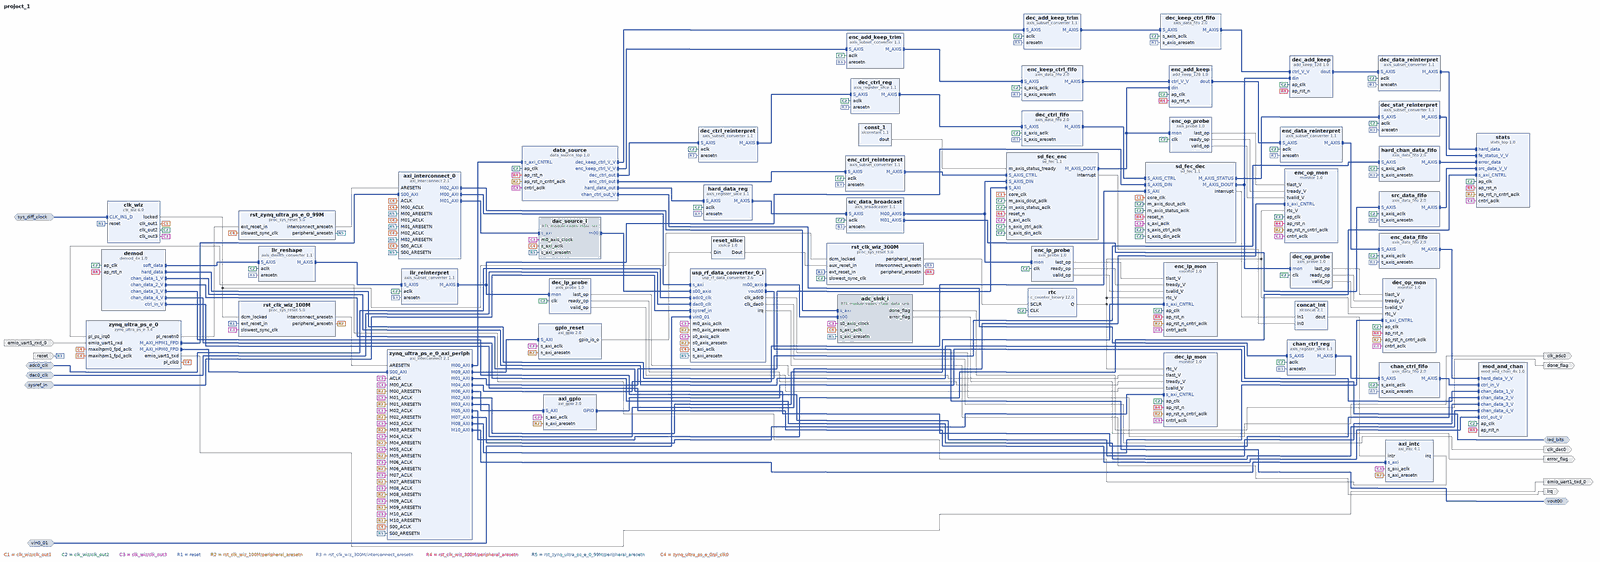
[diagram p0: block diagram of the top level, whole]
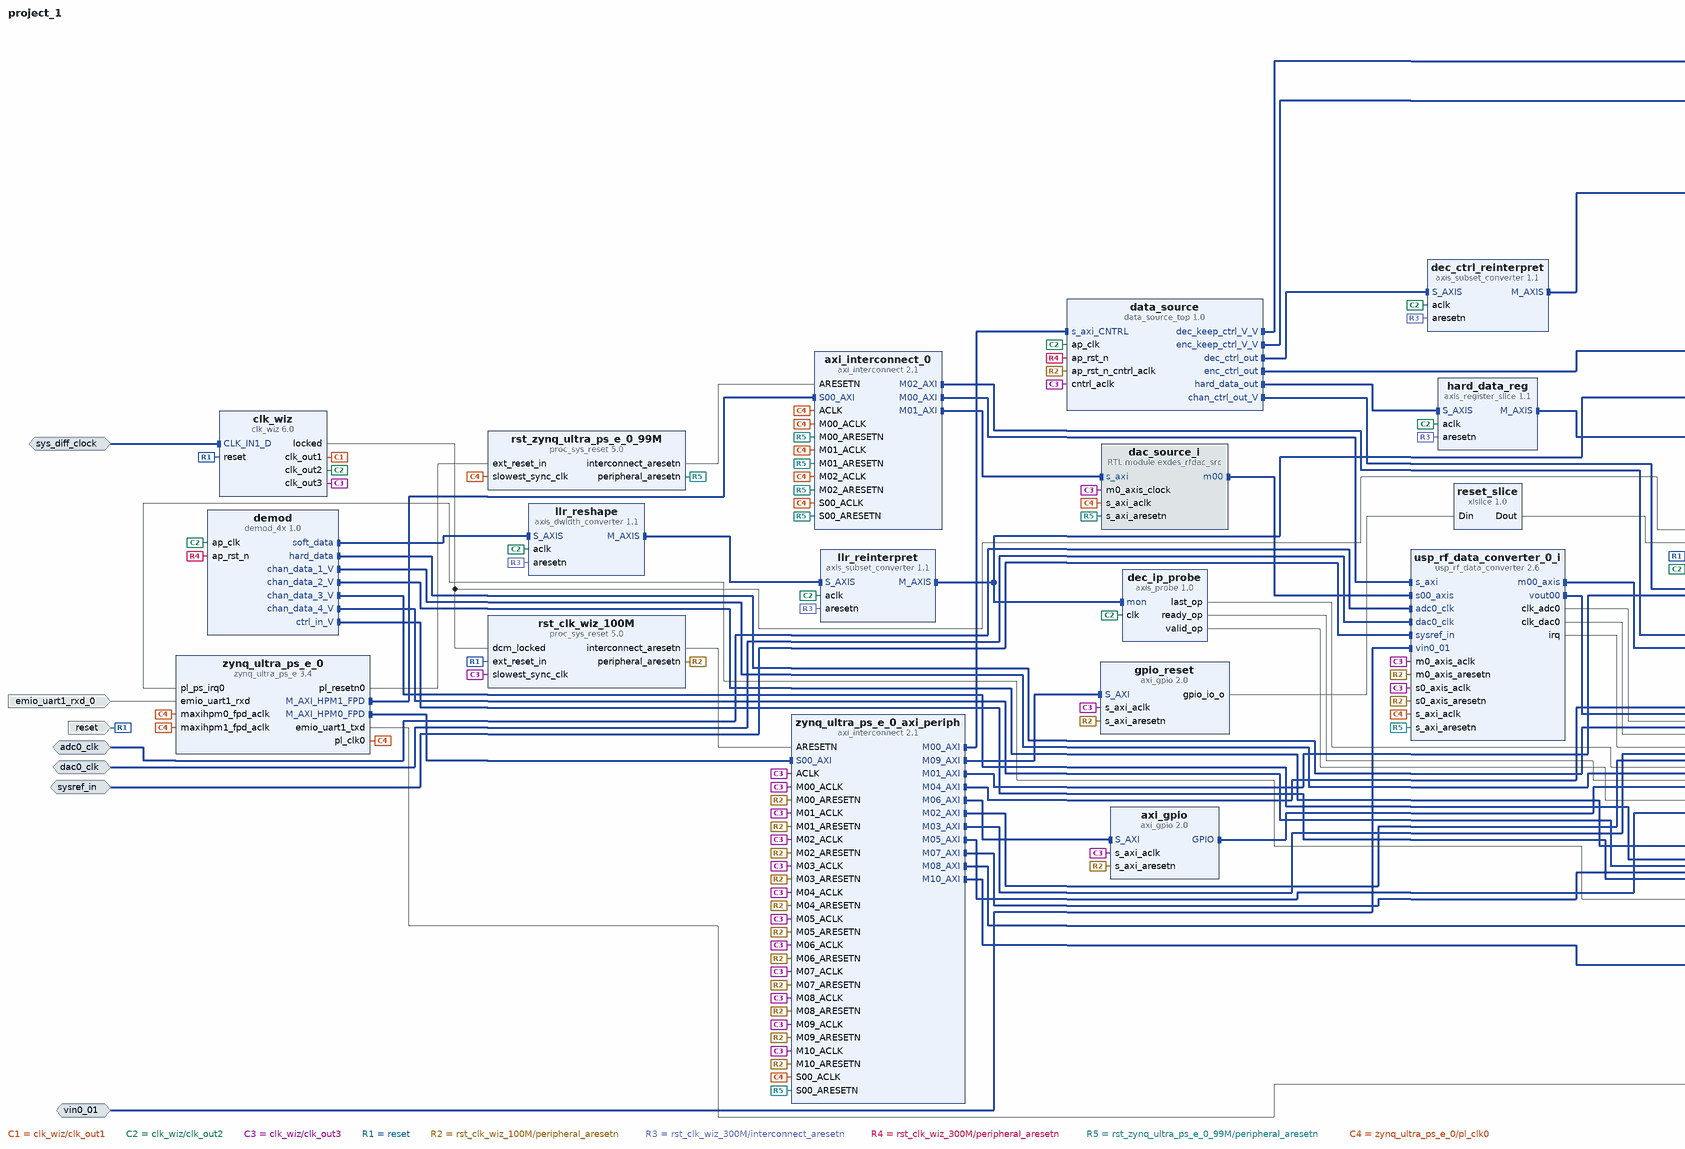
[diagram p1: block diagram of the top level, left part]
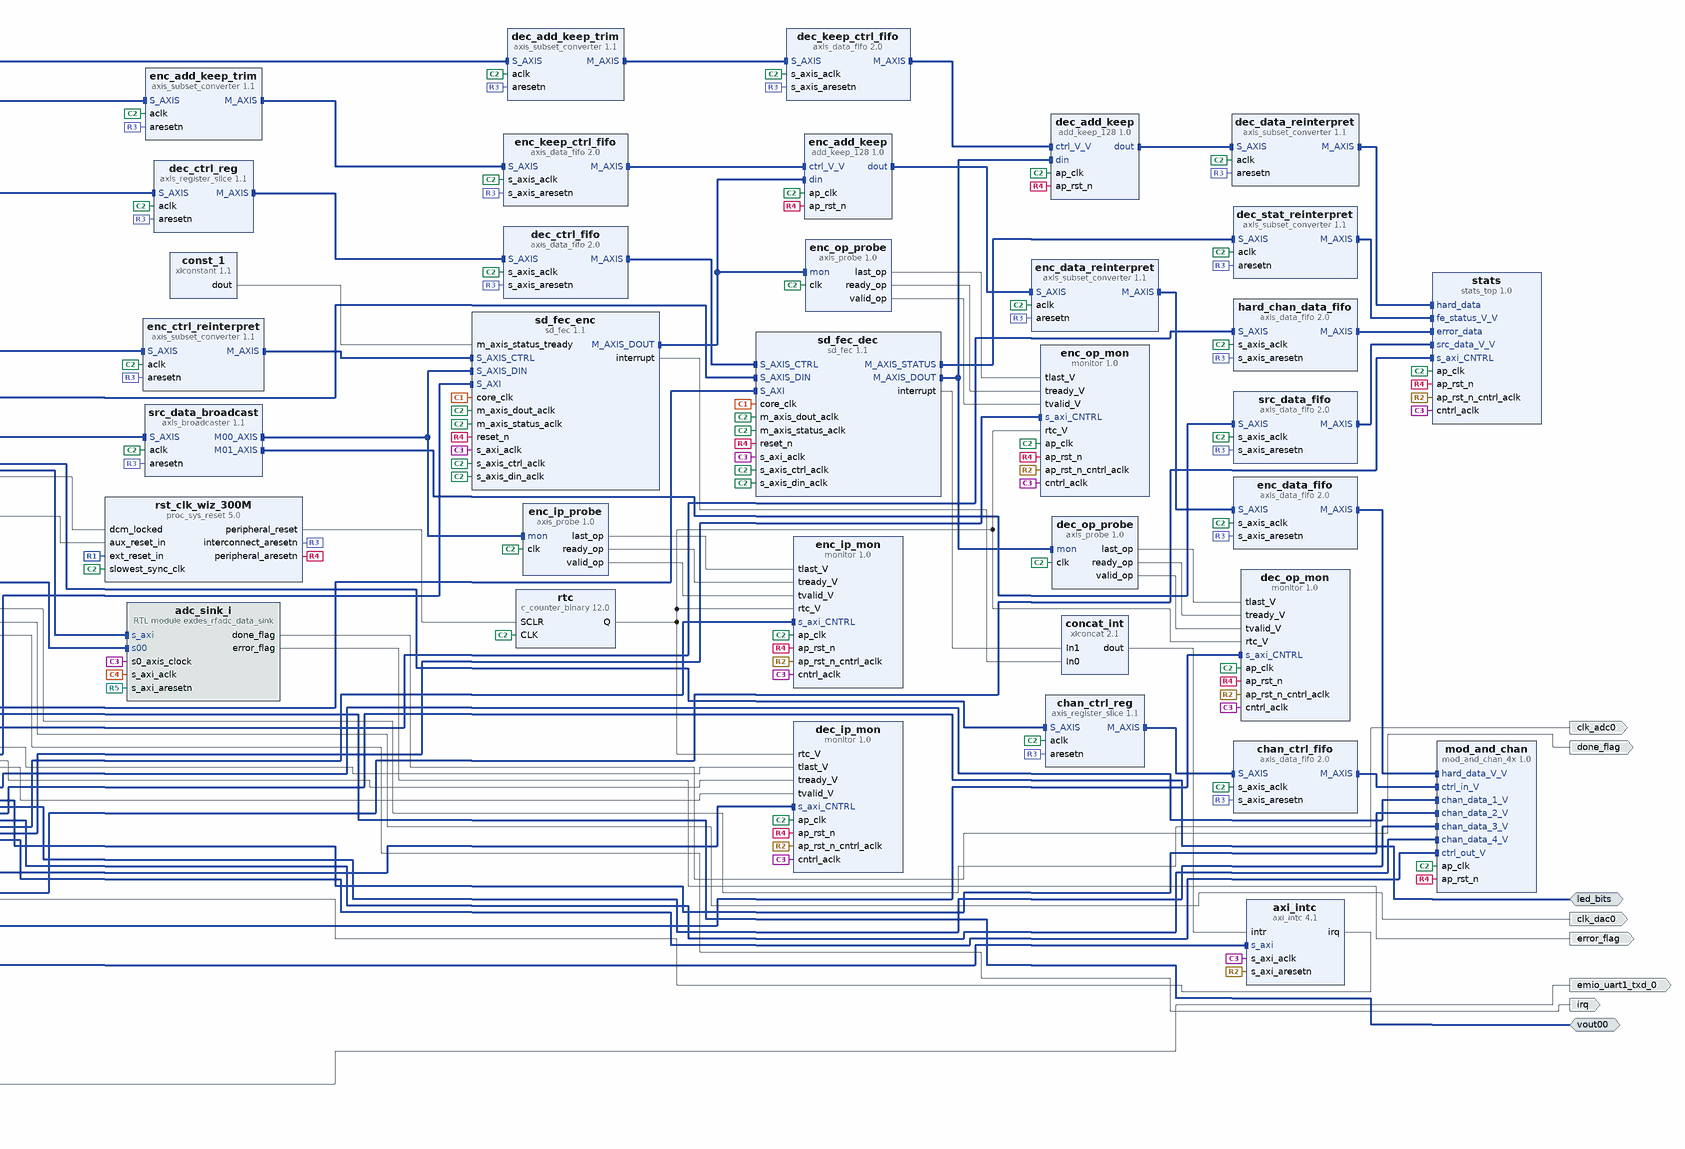
[diagram p2: block diagram of the top level, right part]
# Vivado block design project_1, xczu28dr-ffvg1517-2-e, Vivado 2022.2
create_bd_design project_1

create_bd_intf_port -mode Slave -vlnv xilinx.com:interface:diff_clock_rtl:1.0 adc0_clk
set_property -dict {CONFIG.FREQ_HZ 2000000000.0} [get_bd_intf_ports adc0_clk]
create_bd_intf_port -mode Slave -vlnv xilinx.com:interface:diff_clock_rtl:1.0 dac0_clk
set_property -dict {CONFIG.FREQ_HZ 6400000000.0} [get_bd_intf_ports dac0_clk]
create_bd_intf_port -mode Master -vlnv xilinx.com:interface:gpio_rtl:1.0 led_bits
create_bd_intf_port -mode Slave -vlnv xilinx.com:interface:diff_clock_rtl:1.0 sys_diff_clock
set_property -dict {CONFIG.FREQ_HZ 100000000} [get_bd_intf_ports sys_diff_clock]
create_bd_intf_port -mode Slave -vlnv xilinx.com:display_usp_rf_data_converter:diff_pins_rtl:1.0 sysref_in
create_bd_intf_port -mode Slave -vlnv xilinx.com:interface:diff_analog_io_rtl:1.0 vin0_01
create_bd_intf_port -mode Master -vlnv xilinx.com:interface:diff_analog_io_rtl:1.0 vout00
create_bd_port -dir O -type clk clk_adc0
set_property -dict {CONFIG.FREQ_HZ 125000000.0} [get_bd_ports clk_adc0]
create_bd_port -dir O -type clk clk_dac0
set_property -dict {CONFIG.FREQ_HZ 400000000.0} [get_bd_ports clk_dac0]
create_bd_port -dir O done_flag
create_bd_port -dir I emio_uart1_rxd_0
create_bd_port -dir O emio_uart1_txd_0
create_bd_port -dir O error_flag
create_bd_port -dir O irq
create_bd_port -dir I -type rst reset
set_property -dict {CONFIG.POLARITY ACTIVE_HIGH} [get_bd_ports reset]

create_bd_cell -type ip -vlnv xilinx.com:ip:zynq_ultra_ps_e:3.4 zynq_ultra_ps_e_0
set_property -dict [list \
  CONFIG.PSU_BANK_0_IO_STANDARD LVCMOS18 \
  CONFIG.PSU_BANK_1_IO_STANDARD LVCMOS18 \
  CONFIG.PSU_BANK_2_IO_STANDARD LVCMOS18 \
  CONFIG.PSU_BANK_3_IO_STANDARD LVCMOS33 \
  CONFIG.PSU_DYNAMIC_DDR_CONFIG_EN 1 \
  CONFIG.PSU_USB3__DUAL_CLOCK_ENABLE 1 \
  CONFIG.PSU__CAN1__PERIPHERAL__ENABLE 0 \
  CONFIG.PSU__CRF_APB__ACPU_CTRL__FREQMHZ 1200 \
  CONFIG.PSU__CRF_APB__ACPU_CTRL__SRCSEL APLL \
  CONFIG.PSU__CRF_APB__APLL_CTRL__SRCSEL PSS_REF_CLK \
  CONFIG.PSU__CRF_APB__DBG_FPD_CTRL__FREQMHZ 250 \
  CONFIG.PSU__CRF_APB__DBG_FPD_CTRL__SRCSEL IOPLL \
  CONFIG.PSU__CRF_APB__DBG_TRACE_CTRL__FREQMHZ 250 \
  CONFIG.PSU__CRF_APB__DBG_TRACE_CTRL__SRCSEL IOPLL \
  CONFIG.PSU__CRF_APB__DBG_TSTMP_CTRL__FREQMHZ 250 \
  CONFIG.PSU__CRF_APB__DBG_TSTMP_CTRL__SRCSEL IOPLL \
  CONFIG.PSU__CRF_APB__DDR_CTRL__FREQMHZ 1067 \
  CONFIG.PSU__CRF_APB__DDR_CTRL__SRCSEL DPLL \
  CONFIG.PSU__CRF_APB__DPDMA_REF_CTRL__FREQMHZ 600 \
  CONFIG.PSU__CRF_APB__DPDMA_REF_CTRL__SRCSEL APLL \
  CONFIG.PSU__CRF_APB__DPLL_CTRL__SRCSEL PSS_REF_CLK \
  CONFIG.PSU__CRF_APB__DP_AUDIO_REF_CTRL__SRCSEL RPLL \
  CONFIG.PSU__CRF_APB__DP_STC_REF_CTRL__SRCSEL RPLL \
  CONFIG.PSU__CRF_APB__DP_VIDEO_REF_CTRL__SRCSEL VPLL \
  CONFIG.PSU__CRF_APB__GDMA_REF_CTRL__FREQMHZ 600 \
  CONFIG.PSU__CRF_APB__GDMA_REF_CTRL__SRCSEL APLL \
  CONFIG.PSU__CRF_APB__GPU_REF_CTRL__FREQMHZ 500 \
  CONFIG.PSU__CRF_APB__GPU_REF_CTRL__SRCSEL IOPLL \
  CONFIG.PSU__CRF_APB__TOPSW_LSBUS_CTRL__FREQMHZ 100 \
  CONFIG.PSU__CRF_APB__TOPSW_LSBUS_CTRL__SRCSEL IOPLL \
  CONFIG.PSU__CRF_APB__TOPSW_MAIN_CTRL__FREQMHZ 533.33 \
  CONFIG.PSU__CRF_APB__TOPSW_MAIN_CTRL__SRCSEL DPLL \
  CONFIG.PSU__CRF_APB__VPLL_CTRL__SRCSEL PSS_REF_CLK \
  CONFIG.PSU__CRL_APB__ADMA_REF_CTRL__FREQMHZ 500 \
  CONFIG.PSU__CRL_APB__ADMA_REF_CTRL__SRCSEL IOPLL \
  CONFIG.PSU__CRL_APB__CAN1_REF_CTRL__FREQMHZ 100 \
  CONFIG.PSU__CRL_APB__CAN1_REF_CTRL__SRCSEL IOPLL \
  CONFIG.PSU__CRL_APB__CPU_R5_CTRL__FREQMHZ 500 \
  CONFIG.PSU__CRL_APB__CPU_R5_CTRL__SRCSEL IOPLL \
  CONFIG.PSU__CRL_APB__CSU_PLL_CTRL__FREQMHZ 400 \
  CONFIG.PSU__CRL_APB__CSU_PLL_CTRL__SRCSEL IOPLL \
  CONFIG.PSU__CRL_APB__DBG_LPD_CTRL__FREQMHZ 250 \
  CONFIG.PSU__CRL_APB__DBG_LPD_CTRL__SRCSEL IOPLL \
  CONFIG.PSU__CRL_APB__GEM3_REF_CTRL__FREQMHZ 125 \
  CONFIG.PSU__CRL_APB__GEM3_REF_CTRL__SRCSEL IOPLL \
  CONFIG.PSU__CRL_APB__I2C0_REF_CTRL__FREQMHZ 100 \
  CONFIG.PSU__CRL_APB__I2C0_REF_CTRL__SRCSEL IOPLL \
  CONFIG.PSU__CRL_APB__I2C1_REF_CTRL__FREQMHZ 100 \
  CONFIG.PSU__CRL_APB__I2C1_REF_CTRL__SRCSEL IOPLL \
  CONFIG.PSU__CRL_APB__IOPLL_CTRL__DIV2 0 \
  CONFIG.PSU__CRL_APB__IOPLL_CTRL__SRCSEL PSS_REF_CLK \
  CONFIG.PSU__CRL_APB__IOU_SWITCH_CTRL__FREQMHZ 250 \
  CONFIG.PSU__CRL_APB__IOU_SWITCH_CTRL__SRCSEL IOPLL \
  CONFIG.PSU__CRL_APB__LPD_LSBUS_CTRL__FREQMHZ 100 \
  CONFIG.PSU__CRL_APB__LPD_LSBUS_CTRL__SRCSEL IOPLL \
  CONFIG.PSU__CRL_APB__LPD_SWITCH_CTRL__FREQMHZ 500 \
  CONFIG.PSU__CRL_APB__LPD_SWITCH_CTRL__SRCSEL IOPLL \
  CONFIG.PSU__CRL_APB__PCAP_CTRL__FREQMHZ 200 \
  CONFIG.PSU__CRL_APB__PCAP_CTRL__SRCSEL IOPLL \
  CONFIG.PSU__CRL_APB__PL0_REF_CTRL__FREQMHZ 100 \
  CONFIG.PSU__CRL_APB__PL0_REF_CTRL__SRCSEL IOPLL \
  CONFIG.PSU__CRL_APB__PL1_REF_CTRL__SRCSEL IOPLL \
  CONFIG.PSU__CRL_APB__PL2_REF_CTRL__SRCSEL IOPLL \
  CONFIG.PSU__CRL_APB__PL3_REF_CTRL__SRCSEL IOPLL \
  CONFIG.PSU__CRL_APB__QSPI_REF_CTRL__FREQMHZ 125 \
  CONFIG.PSU__CRL_APB__QSPI_REF_CTRL__SRCSEL IOPLL \
  CONFIG.PSU__CRL_APB__RPLL_CTRL__SRCSEL PSS_REF_CLK \
  CONFIG.PSU__CRL_APB__SDIO0_REF_CTRL__SRCSEL IOPLL \
  CONFIG.PSU__CRL_APB__SDIO1_REF_CTRL__FREQMHZ 200 \
  CONFIG.PSU__CRL_APB__SDIO1_REF_CTRL__SRCSEL IOPLL \
  CONFIG.PSU__CRL_APB__SPI0_REF_CTRL__SRCSEL IOPLL \
  CONFIG.PSU__CRL_APB__SPI1_REF_CTRL__SRCSEL IOPLL \
  CONFIG.PSU__CRL_APB__TIMESTAMP_REF_CTRL__FREQMHZ 100 \
  CONFIG.PSU__CRL_APB__TIMESTAMP_REF_CTRL__SRCSEL IOPLL \
  CONFIG.PSU__CRL_APB__UART0_REF_CTRL__FREQMHZ 100 \
  CONFIG.PSU__CRL_APB__UART0_REF_CTRL__SRCSEL IOPLL \
  CONFIG.PSU__CRL_APB__UART1_REF_CTRL__FREQMHZ 100 \
  CONFIG.PSU__CRL_APB__UART1_REF_CTRL__SRCSEL IOPLL \
  CONFIG.PSU__CRL_APB__USB0_BUS_REF_CTRL__FREQMHZ 250 \
  CONFIG.PSU__CRL_APB__USB0_BUS_REF_CTRL__SRCSEL IOPLL \
  CONFIG.PSU__CRL_APB__USB3_DUAL_REF_CTRL__FREQMHZ 20 \
  CONFIG.PSU__CRL_APB__USB3_DUAL_REF_CTRL__SRCSEL IOPLL \
  CONFIG.PSU__CRL_APB__USB3__ENABLE 1 \
  CONFIG.PSU__CSUPMU__PERIPHERAL__VALID 1 \
  CONFIG.PSU__DDRC__BUS_WIDTH {64 Bit} \
  CONFIG.PSU__DDRC__COMPONENTS UDIMM \
  CONFIG.PSU__DDRC__DEVICE_CAPACITY {4096 MBits} \
  CONFIG.PSU__DDRC__DRAM_WIDTH {8 Bits} \
  CONFIG.PSU__DDRC__ECC Disabled \
  CONFIG.PSU__DDRC__FREQ_MHZ 1066.5 \
  CONFIG.PSU__DDRC__MEMORY_TYPE {DDR 4} \
  CONFIG.PSU__DDRC__SPEED_BIN DDR4_2133P \
  CONFIG.PSU__DDR_HIGH_ADDRESS_GUI_ENABLE 1 \
  CONFIG.PSU__DDR__INTERFACE__FREQMHZ 533.500 \
  CONFIG.PSU__DISPLAYPORT__LANE0__ENABLE 1 \
  CONFIG.PSU__DISPLAYPORT__LANE0__IO {GT Lane1} \
  CONFIG.PSU__DISPLAYPORT__LANE1__ENABLE 1 \
  CONFIG.PSU__DISPLAYPORT__LANE1__IO {GT Lane0} \
  CONFIG.PSU__DISPLAYPORT__PERIPHERAL__ENABLE 1 \
  CONFIG.PSU__DLL__ISUSED 1 \
  CONFIG.PSU__DPAUX__PERIPHERAL__ENABLE 1 \
  CONFIG.PSU__DPAUX__PERIPHERAL__IO {MIO 27 .. 30} \
  CONFIG.PSU__DP__LANE_SEL {Dual Lower} \
  CONFIG.PSU__DP__REF_CLK_FREQ 27 \
  CONFIG.PSU__DP__REF_CLK_SEL {Ref Clk1} \
  CONFIG.PSU__ENET3__FIFO__ENABLE 0 \
  CONFIG.PSU__ENET3__GRP_MDIO__ENABLE 1 \
  CONFIG.PSU__ENET3__GRP_MDIO__IO {MIO 76 .. 77} \
  CONFIG.PSU__ENET3__PERIPHERAL__ENABLE 1 \
  CONFIG.PSU__ENET3__PERIPHERAL__IO {MIO 64 .. 75} \
  CONFIG.PSU__ENET3__PTP__ENABLE 0 \
  CONFIG.PSU__ENET3__TSU__ENABLE 0 \
  CONFIG.PSU__FPGA_PL0_ENABLE 1 \
  CONFIG.PSU__FPGA_PL1_ENABLE 1 \
  CONFIG.PSU__FPGA_PL2_ENABLE 1 \
  CONFIG.PSU__FPGA_PL3_ENABLE 1 \
  CONFIG.PSU__GEM3_COHERENCY 0 \
  CONFIG.PSU__GEM3_ROUTE_THROUGH_FPD 0 \
  CONFIG.PSU__GEM__TSU__ENABLE 0 \
  CONFIG.PSU__GPIO0_MIO__IO {MIO 0 .. 25} \
  CONFIG.PSU__GPIO0_MIO__PERIPHERAL__ENABLE 1 \
  CONFIG.PSU__GPIO1_MIO__IO {MIO 26 .. 51} \
  CONFIG.PSU__GPIO1_MIO__PERIPHERAL__ENABLE 1 \
  CONFIG.PSU__GPIO_EMIO__WIDTH {[91:0]} \
  CONFIG.PSU__GT__LINK_SPEED HBR \
  CONFIG.PSU__GT__PRE_EMPH_LVL_4 0 \
  CONFIG.PSU__GT__VLT_SWNG_LVL_4 0 \
  CONFIG.PSU__I2C0__PERIPHERAL__ENABLE 1 \
  CONFIG.PSU__I2C0__PERIPHERAL__IO {MIO 14 .. 15} \
  CONFIG.PSU__I2C1__PERIPHERAL__ENABLE 1 \
  CONFIG.PSU__I2C1__PERIPHERAL__IO {MIO 16 .. 17} \
  CONFIG.PSU__IOU_SLCR__IOU_TTC_APB_CLK__TTC0_SEL APB \
  CONFIG.PSU__IOU_SLCR__IOU_TTC_APB_CLK__TTC1_SEL APB \
  CONFIG.PSU__IOU_SLCR__IOU_TTC_APB_CLK__TTC2_SEL APB \
  CONFIG.PSU__IOU_SLCR__IOU_TTC_APB_CLK__TTC3_SEL APB \
  CONFIG.PSU__MAXIGP0__DATA_WIDTH 128 \
  CONFIG.PSU__NUM_FABRIC_RESETS 4 \
  CONFIG.PSU__OVERRIDE__BASIC_CLOCK 1 \
  CONFIG.PSU__PMU_COHERENCY 0 \
  CONFIG.PSU__PMU__AIBACK__ENABLE 0 \
  CONFIG.PSU__PMU__EMIO_GPI__ENABLE 0 \
  CONFIG.PSU__PMU__EMIO_GPO__ENABLE 0 \
  CONFIG.PSU__PMU__GPI0__ENABLE 1 \
  CONFIG.PSU__PMU__GPI0__IO {MIO 26} \
  CONFIG.PSU__PMU__GPI1__ENABLE 0 \
  CONFIG.PSU__PMU__GPI2__ENABLE 0 \
  CONFIG.PSU__PMU__GPI3__ENABLE 0 \
  CONFIG.PSU__PMU__GPI4__ENABLE 0 \
  CONFIG.PSU__PMU__GPI5__ENABLE 0 \
  CONFIG.PSU__PMU__GPO0__ENABLE 1 \
  CONFIG.PSU__PMU__GPO0__IO {MIO 32} \
  CONFIG.PSU__PMU__GPO1__ENABLE 1 \
  CONFIG.PSU__PMU__GPO1__IO {MIO 33} \
  CONFIG.PSU__PMU__GPO2__ENABLE 1 \
  CONFIG.PSU__PMU__GPO2__IO {MIO 34} \
  CONFIG.PSU__PMU__GPO2__POLARITY low \
  CONFIG.PSU__PMU__GPO3__ENABLE 1 \
  CONFIG.PSU__PMU__GPO3__IO {MIO 35} \
  CONFIG.PSU__PMU__GPO3__POLARITY low \
  CONFIG.PSU__PMU__GPO4__ENABLE 1 \
  CONFIG.PSU__PMU__GPO4__IO {MIO 36} \
  CONFIG.PSU__PMU__GPO4__POLARITY low \
  CONFIG.PSU__PMU__GPO5__ENABLE 1 \
  CONFIG.PSU__PMU__GPO5__IO {MIO 37} \
  CONFIG.PSU__PMU__GPO5__POLARITY low \
  CONFIG.PSU__PMU__PERIPHERAL__ENABLE 1 \
  CONFIG.PSU__PMU__PLERROR__ENABLE 0 \
  CONFIG.PSU__PRESET_APPLIED 1 \
  CONFIG.PSU__PSS_REF_CLK__FREQMHZ 33.333 \
  CONFIG.PSU__QSPI_COHERENCY 0 \
  CONFIG.PSU__QSPI_ROUTE_THROUGH_FPD 0 \
  CONFIG.PSU__QSPI__GRP_FBCLK__ENABLE 1 \
  CONFIG.PSU__QSPI__GRP_FBCLK__IO {MIO 6} \
  CONFIG.PSU__QSPI__PERIPHERAL__DATA_MODE x4 \
  CONFIG.PSU__QSPI__PERIPHERAL__ENABLE 1 \
  CONFIG.PSU__QSPI__PERIPHERAL__IO {MIO 0 .. 12} \
  CONFIG.PSU__QSPI__PERIPHERAL__MODE {Dual Parallel} \
  CONFIG.PSU__SATA__LANE1__IO {GT Lane3} \
  CONFIG.PSU__SATA__PERIPHERAL__ENABLE 1 \
  CONFIG.PSU__SATA__REF_CLK_FREQ 125 \
  CONFIG.PSU__SATA__REF_CLK_SEL {Ref Clk3} \
  CONFIG.PSU__SD1_COHERENCY 0 \
  CONFIG.PSU__SD1_ROUTE_THROUGH_FPD 0 \
  CONFIG.PSU__SD1__CLK_100_SDR_OTAP_DLY 0x3 \
  CONFIG.PSU__SD1__CLK_200_SDR_OTAP_DLY 0x3 \
  CONFIG.PSU__SD1__CLK_50_DDR_ITAP_DLY 0x3D \
  CONFIG.PSU__SD1__CLK_50_DDR_OTAP_DLY 0x4 \
  CONFIG.PSU__SD1__CLK_50_SDR_ITAP_DLY 0x15 \
  CONFIG.PSU__SD1__CLK_50_SDR_OTAP_DLY 0x5 \
  CONFIG.PSU__SD1__DATA_TRANSFER_MODE 8Bit \
  CONFIG.PSU__SD1__GRP_CD__ENABLE 1 \
  CONFIG.PSU__SD1__GRP_CD__IO {MIO 45} \
  CONFIG.PSU__SD1__GRP_POW__ENABLE 0 \
  CONFIG.PSU__SD1__GRP_WP__ENABLE 0 \
  CONFIG.PSU__SD1__PERIPHERAL__ENABLE 1 \
  CONFIG.PSU__SD1__PERIPHERAL__IO {MIO 39 .. 51} \
  CONFIG.PSU__SD1__SLOT_TYPE {SD 3.0} \
  CONFIG.PSU__SWDT0__CLOCK__ENABLE 0 \
  CONFIG.PSU__SWDT0__PERIPHERAL__ENABLE 1 \
  CONFIG.PSU__SWDT0__RESET__ENABLE 0 \
  CONFIG.PSU__SWDT1__CLOCK__ENABLE 0 \
  CONFIG.PSU__SWDT1__PERIPHERAL__ENABLE 1 \
  CONFIG.PSU__SWDT1__RESET__ENABLE 0 \
  CONFIG.PSU__TSU__BUFG_PORT_PAIR 0 \
  CONFIG.PSU__TTC0__CLOCK__ENABLE 0 \
  CONFIG.PSU__TTC0__PERIPHERAL__ENABLE 1 \
  CONFIG.PSU__TTC0__PERIPHERAL__IO EMIO \
  CONFIG.PSU__TTC0__WAVEOUT__ENABLE 0 \
  CONFIG.PSU__TTC1__CLOCK__ENABLE 0 \
  CONFIG.PSU__TTC1__PERIPHERAL__ENABLE 1 \
  CONFIG.PSU__TTC1__PERIPHERAL__IO EMIO \
  CONFIG.PSU__TTC1__WAVEOUT__ENABLE 0 \
  CONFIG.PSU__TTC2__CLOCK__ENABLE 0 \
  CONFIG.PSU__TTC2__PERIPHERAL__ENABLE 1 \
  CONFIG.PSU__TTC2__PERIPHERAL__IO EMIO \
  CONFIG.PSU__TTC2__WAVEOUT__ENABLE 0 \
  CONFIG.PSU__TTC3__CLOCK__ENABLE 0 \
  CONFIG.PSU__TTC3__PERIPHERAL__ENABLE 1 \
  CONFIG.PSU__TTC3__PERIPHERAL__IO EMIO \
  CONFIG.PSU__TTC3__WAVEOUT__ENABLE 0 \
  CONFIG.PSU__UART0__BAUD_RATE 115200 \
  CONFIG.PSU__UART0__MODEM__ENABLE 0 \
  CONFIG.PSU__UART0__PERIPHERAL__ENABLE 1 \
  CONFIG.PSU__UART0__PERIPHERAL__IO {MIO 18 .. 19} \
  CONFIG.PSU__UART1__BAUD_RATE 115200 \
  CONFIG.PSU__UART1__MODEM__ENABLE 0 \
  CONFIG.PSU__UART1__PERIPHERAL__ENABLE 1 \
  CONFIG.PSU__UART1__PERIPHERAL__IO EMIO \
  CONFIG.PSU__USB0_COHERENCY 0 \
  CONFIG.PSU__USB0__PERIPHERAL__ENABLE 1 \
  CONFIG.PSU__USB0__PERIPHERAL__IO {MIO 52 .. 63} \
  CONFIG.PSU__USB0__REF_CLK_FREQ 26 \
  CONFIG.PSU__USB0__REF_CLK_SEL {Ref Clk2} \
  CONFIG.PSU__USB2_0__EMIO__ENABLE 0 \
  CONFIG.PSU__USB3_0__EMIO__ENABLE 0 \
  CONFIG.PSU__USB3_0__PERIPHERAL__ENABLE 1 \
  CONFIG.PSU__USB3_0__PERIPHERAL__IO {GT Lane2} \
  CONFIG.PSU__USB__RESET__MODE {Boot Pin} \
  CONFIG.PSU__USB__RESET__POLARITY {Active Low} \
  CONFIG.PSU__USE__IRQ0 1 \
  CONFIG.PSU__USE__M_AXI_GP0 1 \
  CONFIG.PSU__USE__M_AXI_GP1 1 \
  CONFIG.PSU__USE__M_AXI_GP2 0 \
] [get_bd_cells zynq_ultra_ps_e_0]
# 221 more settings of zynq_ultra_ps_e_0 are not shown: defaults, MIO pin electricals, DDR timing, and values the tool derives
create_bd_cell -type module -reference exdes_rfadc_data_sink adc_sink_i
create_bd_cell -type ip -vlnv xilinx.com:ip:axi_gpio:2.0 axi_gpio
set_property -dict {CONFIG.C_ALL_OUTPUTS 1 CONFIG.C_GPIO_WIDTH 5} [get_bd_cells axi_gpio]
create_bd_cell -type ip -vlnv xilinx.com:ip:axi_intc:4.1 axi_intc
set_property -dict {CONFIG.C_IRQ_CONNECTION 1} [get_bd_cells axi_intc]
create_bd_cell -type ip -vlnv xilinx.com:ip:axi_interconnect:2.1 axi_interconnect_0
set_property -dict {CONFIG.NUM_MI 3} [get_bd_cells axi_interconnect_0]
create_bd_cell -type ip -vlnv xilinx.com:ip:axis_data_fifo:2.0 chan_ctrl_fifo
set_property -dict {CONFIG.FIFO_DEPTH 512} [get_bd_cells chan_ctrl_fifo]
create_bd_cell -type ip -vlnv xilinx.com:ip:axis_register_slice:1.1 chan_ctrl_reg
create_bd_cell -type ip -vlnv xilinx.com:ip:clk_wiz:6.0 clk_wiz
set_property -dict [list \
  CONFIG.CLKOUT1_JITTER 69.097 \
  CONFIG.CLKOUT1_PHASE_ERROR 76.967 \
  CONFIG.CLKOUT1_REQUESTED_OUT_FREQ 667 \
  CONFIG.CLKOUT2_JITTER 79.341 \
  CONFIG.CLKOUT2_PHASE_ERROR 76.967 \
  CONFIG.CLKOUT2_REQUESTED_OUT_FREQ 300 \
  CONFIG.CLKOUT2_USED true \
  CONFIG.CLKOUT3_JITTER 96.283 \
  CONFIG.CLKOUT3_PHASE_ERROR 76.967 \
  CONFIG.CLKOUT3_REQUESTED_OUT_FREQ 100 \
  CONFIG.CLKOUT3_USED true \
  CONFIG.MMCM_CLKFBOUT_MULT_F 15.000 \
  CONFIG.MMCM_CLKOUT0_DIVIDE_F 2.250 \
  CONFIG.MMCM_CLKOUT1_DIVIDE 5 \
  CONFIG.MMCM_CLKOUT2_DIVIDE 15 \
  CONFIG.NUM_OUT_CLKS 3 \
  CONFIG.PRIM_SOURCE Differential_clock_capable_pin \
] [get_bd_cells clk_wiz]
create_bd_cell -type ip -vlnv xilinx.com:ip:xlconcat:2.1 concat_int
set_property -dict {CONFIG.NUM_PORTS 2} [get_bd_cells concat_int]
create_bd_cell -type ip -vlnv xilinx.com:ip:xlconstant:1.1 const_1
set_property -dict {CONFIG.CONST_VAL 1} [get_bd_cells const_1]
create_bd_cell -type module -reference exdes_rfdac_src dac_source_i
create_bd_cell -type ip -vlnv xilinx.com:hls:data_source_top:1.0 data_source
create_bd_cell -type ip -vlnv xilinx.com:hls:add_keep_128:1.0 dec_add_keep
create_bd_cell -type ip -vlnv xilinx.com:ip:axis_subset_converter:1.1 dec_add_keep_trim
set_property -dict {CONFIG.M_TDATA_NUM_BYTES 2} [get_bd_cells dec_add_keep_trim]
create_bd_cell -type ip -vlnv xilinx.com:ip:axis_data_fifo:2.0 dec_ctrl_fifo
set_property -dict {CONFIG.FIFO_DEPTH 512} [get_bd_cells dec_ctrl_fifo]
create_bd_cell -type ip -vlnv xilinx.com:ip:axis_register_slice:1.1 dec_ctrl_reg
create_bd_cell -type ip -vlnv xilinx.com:ip:axis_subset_converter:1.1 dec_ctrl_reinterpret
set_property -dict {CONFIG.M_TDATA_NUM_BYTES 4} [get_bd_cells dec_ctrl_reinterpret]
create_bd_cell -type ip -vlnv xilinx.com:ip:axis_subset_converter:1.1 dec_data_reinterpret
set_property -dict [list \
  CONFIG.M_TDATA_NUM_BYTES 16 \
  CONFIG.S_TDATA_NUM_BYTES 16 \
  CONFIG.TDATA_REMAP {tdata[127:0]} \
] [get_bd_cells dec_data_reinterpret]
create_bd_cell -type ip -vlnv xilinx.com:hls:monitor:1.0 dec_ip_mon
create_bd_cell -type ip -vlnv xilinx.com:user:axis_probe:1.0 dec_ip_probe
create_bd_cell -type ip -vlnv xilinx.com:ip:axis_data_fifo:2.0 dec_keep_ctrl_fifo
set_property -dict {CONFIG.FIFO_DEPTH 512} [get_bd_cells dec_keep_ctrl_fifo]
create_bd_cell -type ip -vlnv xilinx.com:hls:monitor:1.0 dec_op_mon
create_bd_cell -type ip -vlnv xilinx.com:user:axis_probe:1.0 dec_op_probe
create_bd_cell -type ip -vlnv xilinx.com:ip:axis_subset_converter:1.1 dec_stat_reinterpret
set_property -dict {CONFIG.M_TDATA_NUM_BYTES 5} [get_bd_cells dec_stat_reinterpret]
create_bd_cell -type ip -vlnv xilinx.com:hls:demod_4x:1.0 demod
create_bd_cell -type ip -vlnv xilinx.com:hls:add_keep_128:1.0 enc_add_keep
create_bd_cell -type ip -vlnv xilinx.com:ip:axis_subset_converter:1.1 enc_add_keep_trim
set_property -dict {CONFIG.M_TDATA_NUM_BYTES 2} [get_bd_cells enc_add_keep_trim]
create_bd_cell -type ip -vlnv xilinx.com:ip:axis_subset_converter:1.1 enc_ctrl_reinterpret
set_property -dict {CONFIG.M_TDATA_NUM_BYTES 4} [get_bd_cells enc_ctrl_reinterpret]
create_bd_cell -type ip -vlnv xilinx.com:ip:axis_data_fifo:2.0 enc_data_fifo
set_property -dict {CONFIG.FIFO_DEPTH 32768} [get_bd_cells enc_data_fifo]
create_bd_cell -type ip -vlnv xilinx.com:ip:axis_subset_converter:1.1 enc_data_reinterpret
set_property -dict [list \
  CONFIG.M_TDATA_NUM_BYTES 12 \
  CONFIG.S_TDATA_NUM_BYTES 16 \
  CONFIG.TDATA_REMAP {tdata[95:0]} \
] [get_bd_cells enc_data_reinterpret]
create_bd_cell -type ip -vlnv xilinx.com:hls:monitor:1.0 enc_ip_mon
create_bd_cell -type ip -vlnv xilinx.com:user:axis_probe:1.0 enc_ip_probe
create_bd_cell -type ip -vlnv xilinx.com:ip:axis_data_fifo:2.0 enc_keep_ctrl_fifo
set_property -dict {CONFIG.FIFO_DEPTH 512} [get_bd_cells enc_keep_ctrl_fifo]
create_bd_cell -type ip -vlnv xilinx.com:hls:monitor:1.0 enc_op_mon
create_bd_cell -type ip -vlnv xilinx.com:user:axis_probe:1.0 enc_op_probe
create_bd_cell -type ip -vlnv xilinx.com:ip:axi_gpio:2.0 gpio_reset
set_property -dict {CONFIG.C_ALL_OUTPUTS 1 CONFIG.C_GPIO_WIDTH 8} [get_bd_cells gpio_reset]
create_bd_cell -type ip -vlnv xilinx.com:ip:axis_data_fifo:2.0 hard_chan_data_fifo
set_property -dict {CONFIG.FIFO_DEPTH 16384} [get_bd_cells hard_chan_data_fifo]
create_bd_cell -type ip -vlnv xilinx.com:ip:axis_register_slice:1.1 hard_data_reg
create_bd_cell -type ip -vlnv xilinx.com:ip:axis_subset_converter:1.1 llr_reinterpret
set_property -dict [list \
  CONFIG.M_TDATA_NUM_BYTES 32 \
  CONFIG.S_TDATA_NUM_BYTES 32 \
  CONFIG.TDATA_REMAP {tdata[255:128],tdata[127:0]} \
] [get_bd_cells llr_reinterpret]
create_bd_cell -type ip -vlnv xilinx.com:ip:axis_dwidth_converter:1.1 llr_reshape
set_property -dict {CONFIG.M_TDATA_NUM_BYTES 32} [get_bd_cells llr_reshape]
create_bd_cell -type ip -vlnv xilinx.com:hls:mod_and_chan_4x:1.0 mod_and_chan
create_bd_cell -type ip -vlnv xilinx.com:ip:xlslice:1.0 reset_slice
set_property -dict {CONFIG.DIN_FROM 0 CONFIG.DIN_TO 0 CONFIG.DIN_WIDTH 8} [get_bd_cells reset_slice]
create_bd_cell -type ip -vlnv xilinx.com:ip:proc_sys_reset:5.0 rst_clk_wiz_100M
create_bd_cell -type ip -vlnv xilinx.com:ip:proc_sys_reset:5.0 rst_clk_wiz_300M
set_property -dict {CONFIG.C_AUX_RESET_HIGH 1} [get_bd_cells rst_clk_wiz_300M]
create_bd_cell -type ip -vlnv xilinx.com:ip:proc_sys_reset:5.0 rst_zynq_ultra_ps_e_0_99M
create_bd_cell -type ip -vlnv xilinx.com:ip:c_counter_binary:12.0 rtc
set_property -dict {CONFIG.Output_Width 32 CONFIG.SCLR true} [get_bd_cells rtc]
create_bd_cell -type ip -vlnv xilinx.com:ip:sd_fec:1.1 sd_fec_dec
set_property -dict [list \
  CONFIG.Activity 100 \
  CONFIG.Build_SDK_Project true \
  CONFIG.DIN_Interface Pre-Configured \
  CONFIG.DIN_Lanes 2 \
  CONFIG.DIN_Words 16 \
  CONFIG.DIN_Words_Configuration Fixed \
  CONFIG.DOUT_Interface Pre-Configured \
  CONFIG.DOUT_Lanes 1 \
  CONFIG.DOUT_Words 16 \
  CONFIG.DOUT_Words_Configuration Fixed \
  CONFIG.Enable_Wgt1 false \
  CONFIG.Example_Design_PS_Type ZYNQ_UltraScale+_RFSoC \
  CONFIG.Include_Encoder true \
  CONFIG.Include_PS_Example_Design true \
  CONFIG.LDPC_Decode true \
  CONFIG.LDPC_Decode_Code_Definition ../../../../../../project_1.srcs/sources_1/imports/src/all_code_def.txt \
  CONFIG.LDPC_Decode_Overrides false \
  CONFIG.LDPC_Encode false \
  CONFIG.Parameter_Interface Runtime-Configured \
  CONFIG.Percentage_Loading Automatic \
  CONFIG.Standard Custom \
] [get_bd_cells sd_fec_dec]
create_bd_cell -type ip -vlnv xilinx.com:ip:sd_fec:1.1 sd_fec_enc
set_property -dict [list \
  CONFIG.Activity 100 \
  CONFIG.Build_SDK_Project true \
  CONFIG.DIN_Interface Pre-Configured \
  CONFIG.DIN_Lanes 1 \
  CONFIG.DIN_Words 16 \
  CONFIG.DIN_Words_Configuration Fixed \
  CONFIG.DOUT_Interface Pre-Configured \
  CONFIG.DOUT_Lanes 1 \
  CONFIG.DOUT_Words 12 \
  CONFIG.DOUT_Words_Configuration Fixed \
  CONFIG.Example_Design_PS_Type ZYNQ_UltraScale+_RFSoC \
  CONFIG.Include_Encoder true \
  CONFIG.Include_PS_Example_Design true \
  CONFIG.LDPC_Decode false \
  CONFIG.LDPC_Encode true \
  CONFIG.LDPC_Encode_Code_Definition ../../../../../../project_1.srcs/sources_1/imports/src/all_code_def.txt \
  CONFIG.Parameter_Interface Runtime-Configured \
  CONFIG.Percentage_Loading Automatic \
  CONFIG.Standard Custom \
] [get_bd_cells sd_fec_enc]
create_bd_cell -type ip -vlnv xilinx.com:ip:axis_broadcaster:1.1 src_data_broadcast
create_bd_cell -type ip -vlnv xilinx.com:ip:axis_data_fifo:2.0 src_data_fifo
set_property -dict {CONFIG.FIFO_DEPTH 16384} [get_bd_cells src_data_fifo]
create_bd_cell -type ip -vlnv xilinx.com:hls:stats_top:1.0 stats
create_bd_cell -type ip -vlnv xilinx.com:ip:usp_rf_data_converter:2.6 usp_rf_data_converter_0_i
set_property -dict [list \
  CONFIG.ADC0_Link_Coupling 0 \
  CONFIG.ADC0_Multi_Tile_Sync false \
  CONFIG.ADC0_Outclk_Freq 125.000 \
  CONFIG.ADC0_PLL_Enable false \
  CONFIG.ADC0_Refclk_Freq 2000.000 \
  CONFIG.ADC0_Sampling_Rate 2.0 \
  CONFIG.ADC224_En false \
  CONFIG.ADC225_En false \
  CONFIG.ADC226_En false \
  CONFIG.ADC227_En false \
  CONFIG.ADC_CalOpt_Mode00 1 \
  CONFIG.ADC_Data_Type00 0 \
  CONFIG.ADC_Data_Width00 8 \
  CONFIG.ADC_Debug false \
  CONFIG.ADC_Decimation_Mode00 1 \
  CONFIG.ADC_Dither00 true \
  CONFIG.ADC_Mixer_Mode00 2 \
  CONFIG.ADC_Mixer_Type00 0 \
  CONFIG.ADC_Nyquist00 0 \
  CONFIG.ADC_RTS false \
  CONFIG.ADC_Slice00_Enable true \
  CONFIG.ADC_Slice02_Enable false \
  CONFIG.ADC_Slice10_Enable false \
  CONFIG.ADC_Slice12_Enable false \
  CONFIG.ADC_Slice20_Enable false \
  CONFIG.ADC_Slice22_Enable false \
  CONFIG.ADC_Slice30_Enable false \
  CONFIG.ADC_Slice32_Enable false \
  CONFIG.AMS_Factory_Var 0 \
  CONFIG.Analog_Detection 1 \
  CONFIG.Axiclk_Freq 100.0 \
  CONFIG.Calibration_Freeze false \
  CONFIG.Calibration_Time 10 \
  CONFIG.Clock_Forwarding false \
  CONFIG.Converter_Setup 1 \
  CONFIG.DAC0_Multi_Tile_Sync false \
  CONFIG.DAC0_Outclk_Freq 400.000 \
  CONFIG.DAC0_PLL_Enable false \
  CONFIG.DAC0_Refclk_Freq 6400.000 \
  CONFIG.DAC0_Sampling_Rate 6.4 \
  CONFIG.DAC228_En false \
  CONFIG.DAC229_En false \
  CONFIG.DAC230_En false \
  CONFIG.DAC231_En false \
  CONFIG.DAC_Data_Type00 0 \
  CONFIG.DAC_Data_Width00 16 \
  CONFIG.DAC_Debug false \
  CONFIG.DAC_Decoder_Mode00 0 \
  CONFIG.DAC_Interpolation_Mode00 1 \
  CONFIG.DAC_Invsinc_Ctrl00 false \
  CONFIG.DAC_Mixer_Type00 0 \
  CONFIG.DAC_Nyquist00 0 \
  CONFIG.DAC_Output_Current 0 \
  CONFIG.DAC_RTS false \
  CONFIG.DAC_Slice00_Enable true \
  CONFIG.DAC_Slice01_Enable false \
  CONFIG.DAC_Slice02_Enable false \
  CONFIG.DAC_Slice03_Enable false \
  CONFIG.DAC_Slice10_Enable false \
  CONFIG.DAC_Slice11_Enable false \
  CONFIG.DAC_Slice12_Enable false \
  CONFIG.DAC_Slice13_Enable false \
  CONFIG.PRESET None \
  CONFIG.VNC_Testing false \
  CONFIG.disable_bg_cal_en 0 \
  CONFIG.mDAC_Slice00_Enable false \
  CONFIG.mDAC_Slice01_Enable false \
  CONFIG.mDAC_Slice02_Enable false \
  CONFIG.mDAC_Slice03_Enable false \
  CONFIG.production_simulation 0 \
] [get_bd_cells usp_rf_data_converter_0_i]
create_bd_cell -type ip -vlnv xilinx.com:ip:axi_interconnect:2.1 zynq_ultra_ps_e_0_axi_periph
set_property -dict [list \
  CONFIG.M00_HAS_REGSLICE 4 \
  CONFIG.M01_HAS_REGSLICE 4 \
  CONFIG.M02_HAS_REGSLICE 4 \
  CONFIG.M03_HAS_REGSLICE 4 \
  CONFIG.M04_HAS_REGSLICE 4 \
  CONFIG.M05_HAS_REGSLICE 4 \
  CONFIG.M06_HAS_REGSLICE 4 \
  CONFIG.M07_HAS_REGSLICE 4 \
  CONFIG.M08_HAS_REGSLICE 4 \
  CONFIG.M09_HAS_REGSLICE 4 \
  CONFIG.M10_HAS_REGSLICE 4 \
  CONFIG.NUM_MI 11 \
] [get_bd_cells zynq_ultra_ps_e_0_axi_periph]

# ---- connections ----

connect_bd_intf_net [get_bd_intf_ports adc0_clk] [get_bd_intf_pins usp_rf_data_converter_0_i/adc0_clk]
connect_bd_intf_net [get_bd_intf_ports led_bits] [get_bd_intf_pins axi_gpio/GPIO]
connect_bd_intf_net [get_bd_intf_pins axi_interconnect_0/M00_AXI] [get_bd_intf_pins usp_rf_data_converter_0_i/s_axi]
connect_bd_intf_net [get_bd_intf_pins axi_interconnect_0/M01_AXI] [get_bd_intf_pins dac_source_i/s_axi]
connect_bd_intf_net [get_bd_intf_pins adc_sink_i/s_axi] [get_bd_intf_pins axi_interconnect_0/M02_AXI]
connect_bd_intf_net [get_bd_intf_pins chan_ctrl_fifo/M_AXIS] [get_bd_intf_pins mod_and_chan/ctrl_in_V]
connect_bd_intf_net [get_bd_intf_pins chan_ctrl_fifo/S_AXIS] [get_bd_intf_pins chan_ctrl_reg/M_AXIS]
connect_bd_intf_net [get_bd_intf_ports dac0_clk] [get_bd_intf_pins usp_rf_data_converter_0_i/dac0_clk]
connect_bd_intf_net [get_bd_intf_pins dac_source_i/m00] [get_bd_intf_pins usp_rf_data_converter_0_i/s00_axis]
connect_bd_intf_net [get_bd_intf_pins chan_ctrl_reg/S_AXIS] [get_bd_intf_pins data_source/chan_ctrl_out_V]
connect_bd_intf_net [get_bd_intf_pins data_source/dec_ctrl_out] [get_bd_intf_pins dec_ctrl_reinterpret/S_AXIS]
connect_bd_intf_net [get_bd_intf_pins data_source/dec_keep_ctrl_V_V] [get_bd_intf_pins dec_add_keep_trim/S_AXIS]
connect_bd_intf_net [get_bd_intf_pins data_source/enc_ctrl_out] [get_bd_intf_pins enc_ctrl_reinterpret/S_AXIS]
connect_bd_intf_net [get_bd_intf_pins data_source/enc_keep_ctrl_V_V] [get_bd_intf_pins enc_add_keep_trim/S_AXIS]
connect_bd_intf_net [get_bd_intf_pins data_source/hard_data_out] [get_bd_intf_pins hard_data_reg/S_AXIS]
connect_bd_intf_net [get_bd_intf_pins dec_add_keep/dout] [get_bd_intf_pins dec_data_reinterpret/S_AXIS]
connect_bd_intf_net [get_bd_intf_pins dec_add_keep_trim/M_AXIS] [get_bd_intf_pins dec_keep_ctrl_fifo/S_AXIS]
connect_bd_intf_net [get_bd_intf_pins dec_ctrl_fifo/M_AXIS] [get_bd_intf_pins sd_fec_dec/S_AXIS_CTRL]
connect_bd_intf_net [get_bd_intf_pins dec_ctrl_fifo/S_AXIS] [get_bd_intf_pins dec_ctrl_reg/M_AXIS]
connect_bd_intf_net [get_bd_intf_pins dec_ctrl_reg/S_AXIS] [get_bd_intf_pins dec_ctrl_reinterpret/M_AXIS]
connect_bd_intf_net [get_bd_intf_pins dec_data_reinterpret/M_AXIS] [get_bd_intf_pins stats/hard_data]
connect_bd_intf_net [get_bd_intf_pins dec_add_keep/ctrl_V_V] [get_bd_intf_pins dec_keep_ctrl_fifo/M_AXIS]
connect_bd_intf_net [get_bd_intf_pins dec_stat_reinterpret/M_AXIS] [get_bd_intf_pins stats/fe_status_V_V]
connect_bd_intf_net [get_bd_intf_pins demod/hard_data] [get_bd_intf_pins hard_chan_data_fifo/S_AXIS]
connect_bd_intf_net [get_bd_intf_pins demod/soft_data] [get_bd_intf_pins llr_reshape/S_AXIS]
connect_bd_intf_net -intf_net diff_clock_rtl_0_1 [get_bd_intf_ports sys_diff_clock] [get_bd_intf_pins clk_wiz/CLK_IN1_D]
connect_bd_intf_net [get_bd_intf_pins enc_add_keep/dout] [get_bd_intf_pins enc_data_reinterpret/S_AXIS]
connect_bd_intf_net [get_bd_intf_pins enc_add_keep_trim/M_AXIS] [get_bd_intf_pins enc_keep_ctrl_fifo/S_AXIS]
connect_bd_intf_net [get_bd_intf_pins enc_ctrl_reinterpret/M_AXIS] [get_bd_intf_pins sd_fec_enc/S_AXIS_CTRL]
connect_bd_intf_net [get_bd_intf_pins enc_data_fifo/M_AXIS] [get_bd_intf_pins mod_and_chan/hard_data_V_V]
connect_bd_intf_net [get_bd_intf_pins enc_data_fifo/S_AXIS] [get_bd_intf_pins enc_data_reinterpret/M_AXIS]
connect_bd_intf_net [get_bd_intf_pins enc_add_keep/ctrl_V_V] [get_bd_intf_pins enc_keep_ctrl_fifo/M_AXIS]
connect_bd_intf_net [get_bd_intf_pins hard_chan_data_fifo/M_AXIS] [get_bd_intf_pins stats/error_data]
connect_bd_intf_net [get_bd_intf_pins hard_data_reg/M_AXIS] [get_bd_intf_pins src_data_broadcast/S_AXIS]
connect_bd_intf_net [get_bd_intf_pins llr_reinterpret/M_AXIS] [get_bd_intf_pins sd_fec_dec/S_AXIS_DIN]
connect_bd_intf_net [get_bd_intf_pins llr_reinterpret/M_AXIS] [get_bd_intf_pins dec_ip_probe/mon]
connect_bd_intf_net [get_bd_intf_pins llr_reinterpret/S_AXIS] [get_bd_intf_pins llr_reshape/M_AXIS]
connect_bd_intf_net [get_bd_intf_pins demod/chan_data_1_V] [get_bd_intf_pins mod_and_chan/chan_data_1_V]
connect_bd_intf_net [get_bd_intf_pins demod/chan_data_2_V] [get_bd_intf_pins mod_and_chan/chan_data_2_V]
connect_bd_intf_net [get_bd_intf_pins demod/chan_data_3_V] [get_bd_intf_pins mod_and_chan/chan_data_3_V]
connect_bd_intf_net [get_bd_intf_pins demod/chan_data_4_V] [get_bd_intf_pins mod_and_chan/chan_data_4_V]
connect_bd_intf_net [get_bd_intf_pins demod/ctrl_in_V] [get_bd_intf_pins mod_and_chan/ctrl_out_V]
connect_bd_intf_net [get_bd_intf_pins dec_add_keep/din] [get_bd_intf_pins sd_fec_dec/M_AXIS_DOUT]
connect_bd_intf_net [get_bd_intf_pins dec_add_keep/din] [get_bd_intf_pins dec_op_probe/mon]
connect_bd_intf_net [get_bd_intf_pins dec_stat_reinterpret/S_AXIS] [get_bd_intf_pins sd_fec_dec/M_AXIS_STATUS]
connect_bd_intf_net [get_bd_intf_pins enc_add_keep/din] [get_bd_intf_pins sd_fec_enc/M_AXIS_DOUT]
connect_bd_intf_net [get_bd_intf_pins enc_add_keep/din] [get_bd_intf_pins enc_op_probe/mon]
connect_bd_intf_net [get_bd_intf_pins sd_fec_enc/S_AXIS_DIN] [get_bd_intf_pins src_data_broadcast/M00_AXIS]
connect_bd_intf_net [get_bd_intf_pins sd_fec_enc/S_AXIS_DIN] [get_bd_intf_pins enc_ip_probe/mon]
connect_bd_intf_net [get_bd_intf_pins src_data_broadcast/M01_AXIS] [get_bd_intf_pins src_data_fifo/S_AXIS]
connect_bd_intf_net [get_bd_intf_pins src_data_fifo/M_AXIS] [get_bd_intf_pins stats/src_data_V_V]
connect_bd_intf_net [get_bd_intf_ports sysref_in] [get_bd_intf_pins usp_rf_data_converter_0_i/sysref_in]
connect_bd_intf_net [get_bd_intf_pins adc_sink_i/s00] [get_bd_intf_pins usp_rf_data_converter_0_i/m00_axis]
connect_bd_intf_net [get_bd_intf_ports vout00] [get_bd_intf_pins usp_rf_data_converter_0_i/vout00]
connect_bd_intf_net -intf_net vin0_01_0_1 [get_bd_intf_ports vin0_01] [get_bd_intf_pins usp_rf_data_converter_0_i/vin0_01]
connect_bd_intf_net [get_bd_intf_pins zynq_ultra_ps_e_0/M_AXI_HPM0_FPD] [get_bd_intf_pins zynq_ultra_ps_e_0_axi_periph/S00_AXI]
connect_bd_intf_net [get_bd_intf_pins axi_interconnect_0/S00_AXI] [get_bd_intf_pins zynq_ultra_ps_e_0/M_AXI_HPM1_FPD]
connect_bd_intf_net [get_bd_intf_pins data_source/s_axi_CNTRL] [get_bd_intf_pins zynq_ultra_ps_e_0_axi_periph/M00_AXI]
connect_bd_intf_net [get_bd_intf_pins sd_fec_enc/S_AXI] [get_bd_intf_pins zynq_ultra_ps_e_0_axi_periph/M01_AXI]
connect_bd_intf_net [get_bd_intf_pins enc_ip_mon/s_axi_CNTRL] [get_bd_intf_pins zynq_ultra_ps_e_0_axi_periph/M02_AXI]
connect_bd_intf_net [get_bd_intf_pins enc_op_mon/s_axi_CNTRL] [get_bd_intf_pins zynq_ultra_ps_e_0_axi_periph/M03_AXI]
connect_bd_intf_net [get_bd_intf_pins sd_fec_dec/S_AXI] [get_bd_intf_pins zynq_ultra_ps_e_0_axi_periph/M04_AXI]
connect_bd_intf_net [get_bd_intf_pins stats/s_axi_CNTRL] [get_bd_intf_pins zynq_ultra_ps_e_0_axi_periph/M05_AXI]
connect_bd_intf_net [get_bd_intf_pins axi_gpio/S_AXI] [get_bd_intf_pins zynq_ultra_ps_e_0_axi_periph/M06_AXI]
connect_bd_intf_net [get_bd_intf_pins dec_ip_mon/s_axi_CNTRL] [get_bd_intf_pins zynq_ultra_ps_e_0_axi_periph/M07_AXI]
connect_bd_intf_net [get_bd_intf_pins dec_op_mon/s_axi_CNTRL] [get_bd_intf_pins zynq_ultra_ps_e_0_axi_periph/M08_AXI]
connect_bd_intf_net [get_bd_intf_pins gpio_reset/S_AXI] [get_bd_intf_pins zynq_ultra_ps_e_0_axi_periph/M09_AXI]
connect_bd_intf_net [get_bd_intf_pins axi_intc/s_axi] [get_bd_intf_pins zynq_ultra_ps_e_0_axi_periph/M10_AXI]
connect_bd_net -net ARESETN_1 [get_bd_pins rst_zynq_ultra_ps_e_0_99M/interconnect_aresetn] [get_bd_pins axi_interconnect_0/ARESETN]
connect_bd_net [get_bd_pins adc_sink_i/done_flag] [get_bd_ports done_flag]
connect_bd_net [get_bd_pins adc_sink_i/error_flag] [get_bd_ports error_flag]
connect_bd_net [get_bd_pins axi_intc/irq] [get_bd_pins zynq_ultra_ps_e_0/pl_ps_irq0]
connect_bd_net [get_bd_pins clk_wiz/clk_out1] [get_bd_pins sd_fec_dec/core_clk] [get_bd_pins sd_fec_enc/core_clk]
connect_bd_net [get_bd_pins clk_wiz/clk_out2] \
  [get_bd_pins chan_ctrl_fifo/s_axis_aclk] [get_bd_pins chan_ctrl_reg/aclk] [get_bd_pins data_source/ap_clk] \
  [get_bd_pins dec_add_keep/ap_clk] [get_bd_pins dec_add_keep_trim/aclk] [get_bd_pins dec_ctrl_fifo/s_axis_aclk] \
  [get_bd_pins dec_ctrl_reg/aclk] [get_bd_pins dec_ctrl_reinterpret/aclk] [get_bd_pins dec_data_reinterpret/aclk] \
  [get_bd_pins dec_ip_mon/ap_clk] [get_bd_pins dec_ip_probe/clk] [get_bd_pins dec_keep_ctrl_fifo/s_axis_aclk] \
  [get_bd_pins dec_op_mon/ap_clk] [get_bd_pins dec_op_probe/clk] [get_bd_pins dec_stat_reinterpret/aclk] \
  [get_bd_pins demod/ap_clk] [get_bd_pins enc_add_keep/ap_clk] [get_bd_pins enc_add_keep_trim/aclk] \
  [get_bd_pins enc_ctrl_reinterpret/aclk] [get_bd_pins enc_data_fifo/s_axis_aclk] [get_bd_pins enc_data_reinterpret/aclk] \
  [get_bd_pins enc_ip_mon/ap_clk] [get_bd_pins enc_ip_probe/clk] [get_bd_pins enc_keep_ctrl_fifo/s_axis_aclk] \
  [get_bd_pins enc_op_mon/ap_clk] [get_bd_pins enc_op_probe/clk] [get_bd_pins hard_chan_data_fifo/s_axis_aclk] \
  [get_bd_pins hard_data_reg/aclk] [get_bd_pins llr_reinterpret/aclk] [get_bd_pins llr_reshape/aclk] \
  [get_bd_pins mod_and_chan/ap_clk] [get_bd_pins rst_clk_wiz_300M/slowest_sync_clk] [get_bd_pins rtc/CLK] \
  [get_bd_pins sd_fec_dec/m_axis_dout_aclk] [get_bd_pins sd_fec_dec/m_axis_status_aclk] \
  [get_bd_pins sd_fec_dec/s_axis_ctrl_aclk] [get_bd_pins sd_fec_dec/s_axis_din_aclk] \
  [get_bd_pins sd_fec_enc/m_axis_dout_aclk] [get_bd_pins sd_fec_enc/m_axis_status_aclk] \
  [get_bd_pins sd_fec_enc/s_axis_ctrl_aclk] [get_bd_pins sd_fec_enc/s_axis_din_aclk] [get_bd_pins src_data_broadcast/aclk] \
  [get_bd_pins src_data_fifo/s_axis_aclk] [get_bd_pins stats/ap_clk]
connect_bd_net [get_bd_pins clk_wiz/clk_out3] \
  [get_bd_pins adc_sink_i/s0_axis_clock] [get_bd_pins axi_gpio/s_axi_aclk] [get_bd_pins axi_intc/s_axi_aclk] \
  [get_bd_pins dac_source_i/m0_axis_clock] [get_bd_pins data_source/cntrl_aclk] [get_bd_pins dec_ip_mon/cntrl_aclk] \
  [get_bd_pins dec_op_mon/cntrl_aclk] [get_bd_pins enc_ip_mon/cntrl_aclk] [get_bd_pins enc_op_mon/cntrl_aclk] \
  [get_bd_pins gpio_reset/s_axi_aclk] [get_bd_pins rst_clk_wiz_100M/slowest_sync_clk] [get_bd_pins sd_fec_dec/s_axi_aclk] \
  [get_bd_pins sd_fec_enc/s_axi_aclk] [get_bd_pins stats/cntrl_aclk] [get_bd_pins usp_rf_data_converter_0_i/m0_axis_aclk] \
  [get_bd_pins usp_rf_data_converter_0_i/s0_axis_aclk] [get_bd_pins zynq_ultra_ps_e_0_axi_periph/ACLK] \
  [get_bd_pins zynq_ultra_ps_e_0_axi_periph/M00_ACLK] [get_bd_pins zynq_ultra_ps_e_0_axi_periph/M01_ACLK] \
  [get_bd_pins zynq_ultra_ps_e_0_axi_periph/M02_ACLK] [get_bd_pins zynq_ultra_ps_e_0_axi_periph/M03_ACLK] \
  [get_bd_pins zynq_ultra_ps_e_0_axi_periph/M04_ACLK] [get_bd_pins zynq_ultra_ps_e_0_axi_periph/M05_ACLK] \
  [get_bd_pins zynq_ultra_ps_e_0_axi_periph/M06_ACLK] [get_bd_pins zynq_ultra_ps_e_0_axi_periph/M07_ACLK] \
  [get_bd_pins zynq_ultra_ps_e_0_axi_periph/M08_ACLK] [get_bd_pins zynq_ultra_ps_e_0_axi_periph/M09_ACLK] \
  [get_bd_pins zynq_ultra_ps_e_0_axi_periph/M10_ACLK]
connect_bd_net [get_bd_pins clk_wiz/locked] [get_bd_pins rst_clk_wiz_100M/dcm_locked] [get_bd_pins rst_clk_wiz_300M/dcm_locked]
connect_bd_net [get_bd_pins concat_int/dout] [get_bd_pins axi_intc/intr]
connect_bd_net [get_bd_pins const_1/dout] [get_bd_pins sd_fec_enc/m_axis_status_tready]
connect_bd_net [get_bd_pins dec_ip_probe/last_op] [get_bd_pins dec_ip_mon/tlast_V]
connect_bd_net [get_bd_pins dec_ip_probe/ready_op] [get_bd_pins dec_ip_mon/tready_V]
connect_bd_net [get_bd_pins dec_ip_probe/valid_op] [get_bd_pins dec_ip_mon/tvalid_V]
connect_bd_net [get_bd_pins dec_op_probe/last_op] [get_bd_pins dec_op_mon/tlast_V]
connect_bd_net [get_bd_pins dec_op_probe/ready_op] [get_bd_pins dec_op_mon/tready_V]
connect_bd_net [get_bd_pins dec_op_probe/valid_op] [get_bd_pins dec_op_mon/tvalid_V]
connect_bd_net -net emio_uart1_rxd_0_1 [get_bd_ports emio_uart1_rxd_0] [get_bd_pins zynq_ultra_ps_e_0/emio_uart1_rxd]
connect_bd_net [get_bd_pins enc_ip_probe/last_op] [get_bd_pins enc_ip_mon/tlast_V]
connect_bd_net [get_bd_pins enc_ip_probe/ready_op] [get_bd_pins enc_ip_mon/tready_V]
connect_bd_net [get_bd_pins enc_ip_probe/valid_op] [get_bd_pins enc_ip_mon/tvalid_V]
connect_bd_net [get_bd_pins enc_op_probe/last_op] [get_bd_pins enc_op_mon/tlast_V]
connect_bd_net [get_bd_pins enc_op_probe/ready_op] [get_bd_pins enc_op_mon/tready_V]
connect_bd_net [get_bd_pins enc_op_probe/valid_op] [get_bd_pins enc_op_mon/tvalid_V]
connect_bd_net [get_bd_pins gpio_reset/gpio_io_o] [get_bd_pins reset_slice/Din]
connect_bd_net -net reset_rtl_0_1 [get_bd_ports reset] \
  [get_bd_pins clk_wiz/reset] [get_bd_pins rst_clk_wiz_100M/ext_reset_in] [get_bd_pins rst_clk_wiz_300M/ext_reset_in]
connect_bd_net [get_bd_pins reset_slice/Dout] [get_bd_pins rst_clk_wiz_300M/aux_reset_in]
connect_bd_net [get_bd_pins rst_clk_wiz_100M/interconnect_aresetn] [get_bd_pins zynq_ultra_ps_e_0_axi_periph/ARESETN]
connect_bd_net [get_bd_pins rst_clk_wiz_100M/peripheral_aresetn] \
  [get_bd_pins axi_gpio/s_axi_aresetn] [get_bd_pins axi_intc/s_axi_aresetn] [get_bd_pins data_source/ap_rst_n_cntrl_aclk] \
  [get_bd_pins dec_ip_mon/ap_rst_n_cntrl_aclk] [get_bd_pins dec_op_mon/ap_rst_n_cntrl_aclk] \
  [get_bd_pins enc_ip_mon/ap_rst_n_cntrl_aclk] [get_bd_pins enc_op_mon/ap_rst_n_cntrl_aclk] \
  [get_bd_pins gpio_reset/s_axi_aresetn] [get_bd_pins stats/ap_rst_n_cntrl_aclk] \
  [get_bd_pins usp_rf_data_converter_0_i/s0_axis_aresetn] [get_bd_pins zynq_ultra_ps_e_0_axi_periph/M00_ARESETN] \
  [get_bd_pins zynq_ultra_ps_e_0_axi_periph/M01_ARESETN] [get_bd_pins zynq_ultra_ps_e_0_axi_periph/M02_ARESETN] \
  [get_bd_pins zynq_ultra_ps_e_0_axi_periph/M03_ARESETN] [get_bd_pins zynq_ultra_ps_e_0_axi_periph/M04_ARESETN] \
  [get_bd_pins zynq_ultra_ps_e_0_axi_periph/M05_ARESETN] [get_bd_pins zynq_ultra_ps_e_0_axi_periph/M06_ARESETN] \
  [get_bd_pins zynq_ultra_ps_e_0_axi_periph/M07_ARESETN] [get_bd_pins zynq_ultra_ps_e_0_axi_periph/M08_ARESETN] \
  [get_bd_pins zynq_ultra_ps_e_0_axi_periph/M09_ARESETN] [get_bd_pins zynq_ultra_ps_e_0_axi_periph/M10_ARESETN] \
  [get_bd_pins usp_rf_data_converter_0_i/m0_axis_aresetn]
connect_bd_net [get_bd_pins rst_clk_wiz_300M/interconnect_aresetn] \
  [get_bd_pins chan_ctrl_fifo/s_axis_aresetn] [get_bd_pins chan_ctrl_reg/aresetn] [get_bd_pins dec_add_keep_trim/aresetn] \
  [get_bd_pins dec_ctrl_fifo/s_axis_aresetn] [get_bd_pins dec_ctrl_reg/aresetn] [get_bd_pins dec_ctrl_reinterpret/aresetn] \
  [get_bd_pins dec_data_reinterpret/aresetn] [get_bd_pins dec_keep_ctrl_fifo/s_axis_aresetn] \
  [get_bd_pins dec_stat_reinterpret/aresetn] [get_bd_pins enc_add_keep_trim/aresetn] \
  [get_bd_pins enc_ctrl_reinterpret/aresetn] [get_bd_pins enc_data_fifo/s_axis_aresetn] \
  [get_bd_pins enc_data_reinterpret/aresetn] [get_bd_pins enc_keep_ctrl_fifo/s_axis_aresetn] \
  [get_bd_pins hard_chan_data_fifo/s_axis_aresetn] [get_bd_pins hard_data_reg/aresetn] [get_bd_pins llr_reinterpret/aresetn] \
  [get_bd_pins llr_reshape/aresetn] [get_bd_pins src_data_broadcast/aresetn] [get_bd_pins src_data_fifo/s_axis_aresetn]
connect_bd_net [get_bd_pins rst_clk_wiz_300M/peripheral_aresetn] \
  [get_bd_pins data_source/ap_rst_n] [get_bd_pins dec_add_keep/ap_rst_n] [get_bd_pins dec_ip_mon/ap_rst_n] \
  [get_bd_pins dec_op_mon/ap_rst_n] [get_bd_pins demod/ap_rst_n] [get_bd_pins enc_add_keep/ap_rst_n] \
  [get_bd_pins enc_ip_mon/ap_rst_n] [get_bd_pins enc_op_mon/ap_rst_n] [get_bd_pins mod_and_chan/ap_rst_n] \
  [get_bd_pins sd_fec_dec/reset_n] [get_bd_pins sd_fec_enc/reset_n] [get_bd_pins stats/ap_rst_n]
connect_bd_net [get_bd_pins rst_clk_wiz_300M/peripheral_reset] [get_bd_pins rtc/SCLR]
connect_bd_net [get_bd_pins rst_zynq_ultra_ps_e_0_99M/peripheral_aresetn] \
  [get_bd_pins axi_interconnect_0/M00_ARESETN] [get_bd_pins axi_interconnect_0/M01_ARESETN] \
  [get_bd_pins axi_interconnect_0/M02_ARESETN] [get_bd_pins axi_interconnect_0/S00_ARESETN] \
  [get_bd_pins dac_source_i/s_axi_aresetn] [get_bd_pins usp_rf_data_converter_0_i/s_axi_aresetn] \
  [get_bd_pins zynq_ultra_ps_e_0_axi_periph/S00_ARESETN] [get_bd_pins adc_sink_i/s_axi_aresetn]
connect_bd_net [get_bd_pins rtc/Q] \
  [get_bd_pins dec_ip_mon/rtc_V] [get_bd_pins dec_op_mon/rtc_V] [get_bd_pins enc_ip_mon/rtc_V] [get_bd_pins enc_op_mon/rtc_V]
connect_bd_net [get_bd_pins sd_fec_dec/interrupt] [get_bd_pins concat_int/In1]
connect_bd_net [get_bd_pins sd_fec_enc/interrupt] [get_bd_pins concat_int/In0]
connect_bd_net [get_bd_pins usp_rf_data_converter_0_i/clk_adc0] [get_bd_ports clk_adc0]
connect_bd_net [get_bd_pins usp_rf_data_converter_0_i/clk_dac0] [get_bd_ports clk_dac0]
connect_bd_net [get_bd_pins usp_rf_data_converter_0_i/irq] [get_bd_ports irq]
connect_bd_net [get_bd_pins zynq_ultra_ps_e_0/emio_uart1_txd] [get_bd_ports emio_uart1_txd_0]
connect_bd_net [get_bd_pins zynq_ultra_ps_e_0/pl_clk0] \
  [get_bd_pins adc_sink_i/s_axi_aclk] [get_bd_pins axi_interconnect_0/ACLK] [get_bd_pins axi_interconnect_0/M00_ACLK] \
  [get_bd_pins axi_interconnect_0/M01_ACLK] [get_bd_pins axi_interconnect_0/M02_ACLK] \
  [get_bd_pins axi_interconnect_0/S00_ACLK] [get_bd_pins dac_source_i/s_axi_aclk] \
  [get_bd_pins rst_zynq_ultra_ps_e_0_99M/slowest_sync_clk] [get_bd_pins usp_rf_data_converter_0_i/s_axi_aclk] \
  [get_bd_pins zynq_ultra_ps_e_0/maxihpm0_fpd_aclk] [get_bd_pins zynq_ultra_ps_e_0/maxihpm1_fpd_aclk] \
  [get_bd_pins zynq_ultra_ps_e_0_axi_periph/S00_ACLK]
connect_bd_net [get_bd_pins zynq_ultra_ps_e_0/pl_resetn0] [get_bd_pins rst_zynq_ultra_ps_e_0_99M/ext_reset_in]

# ---- address map ----
assign_bd_address -offset 0x00A0000000 -range 64K -target_address_space [get_bd_addr_spaces zynq_ultra_ps_e_0/Data] [get_bd_addr_segs data_source/s_axi_CNTRL/Reg]
assign_bd_address -offset 0x00A0010000 -range 64K -target_address_space [get_bd_addr_spaces zynq_ultra_ps_e_0/Data] [get_bd_addr_segs enc_ip_mon/s_axi_CNTRL/Reg]
assign_bd_address -offset 0x00A0020000 -range 64K -target_address_space [get_bd_addr_spaces zynq_ultra_ps_e_0/Data] [get_bd_addr_segs enc_op_mon/s_axi_CNTRL/Reg]
assign_bd_address -offset 0x00A0030000 -range 64K -target_address_space [get_bd_addr_spaces zynq_ultra_ps_e_0/Data] [get_bd_addr_segs stats/s_axi_CNTRL/Reg]
assign_bd_address -offset 0x00A0040000 -range 256K -target_address_space [get_bd_addr_spaces zynq_ultra_ps_e_0/Data] [get_bd_addr_segs sd_fec_enc/S_AXI/PARAMS]
assign_bd_address -offset 0x00A0080000 -range 256K -target_address_space [get_bd_addr_spaces zynq_ultra_ps_e_0/Data] [get_bd_addr_segs sd_fec_dec/S_AXI/PARAMS]
assign_bd_address -offset 0x00A00C0000 -range 4K -target_address_space [get_bd_addr_spaces zynq_ultra_ps_e_0/Data] [get_bd_addr_segs axi_gpio/S_AXI/Reg]
assign_bd_address -offset 0x00A00C1000 -range 4K -target_address_space [get_bd_addr_spaces zynq_ultra_ps_e_0/Data] [get_bd_addr_segs gpio_reset/S_AXI/Reg]
assign_bd_address -offset 0x00A00C2000 -range 4K -target_address_space [get_bd_addr_spaces zynq_ultra_ps_e_0/Data] [get_bd_addr_segs axi_intc/S_AXI/Reg]
assign_bd_address -offset 0x00A00D0000 -range 64K -target_address_space [get_bd_addr_spaces zynq_ultra_ps_e_0/Data] [get_bd_addr_segs dec_ip_mon/s_axi_CNTRL/Reg]
assign_bd_address -offset 0x00A00E0000 -range 64K -target_address_space [get_bd_addr_spaces zynq_ultra_ps_e_0/Data] [get_bd_addr_segs dec_op_mon/s_axi_CNTRL/Reg]
assign_bd_address -offset 0x00B0000000 -range 256K -target_address_space [get_bd_addr_spaces zynq_ultra_ps_e_0/Data] [get_bd_addr_segs adc_sink_i/s_axi/reg0]
assign_bd_address -offset 0x00B0040000 -range 256K -target_address_space [get_bd_addr_spaces zynq_ultra_ps_e_0/Data] [get_bd_addr_segs dac_source_i/s_axi/reg0]
assign_bd_address -offset 0x00B0080000 -range 256K -target_address_space [get_bd_addr_spaces zynq_ultra_ps_e_0/Data] [get_bd_addr_segs usp_rf_data_converter_0_i/s_axi/Reg]

validate_bd_design
save_bd_design
